# Altium schematic sheet RoBeast_Positional_Feedback.SchDoc: Positional Feedback
size A4; ApprovedBy: CR; DrawnBy: VM & IG; Revision: V1; SheetNumber: 5; SheetTotal: 9
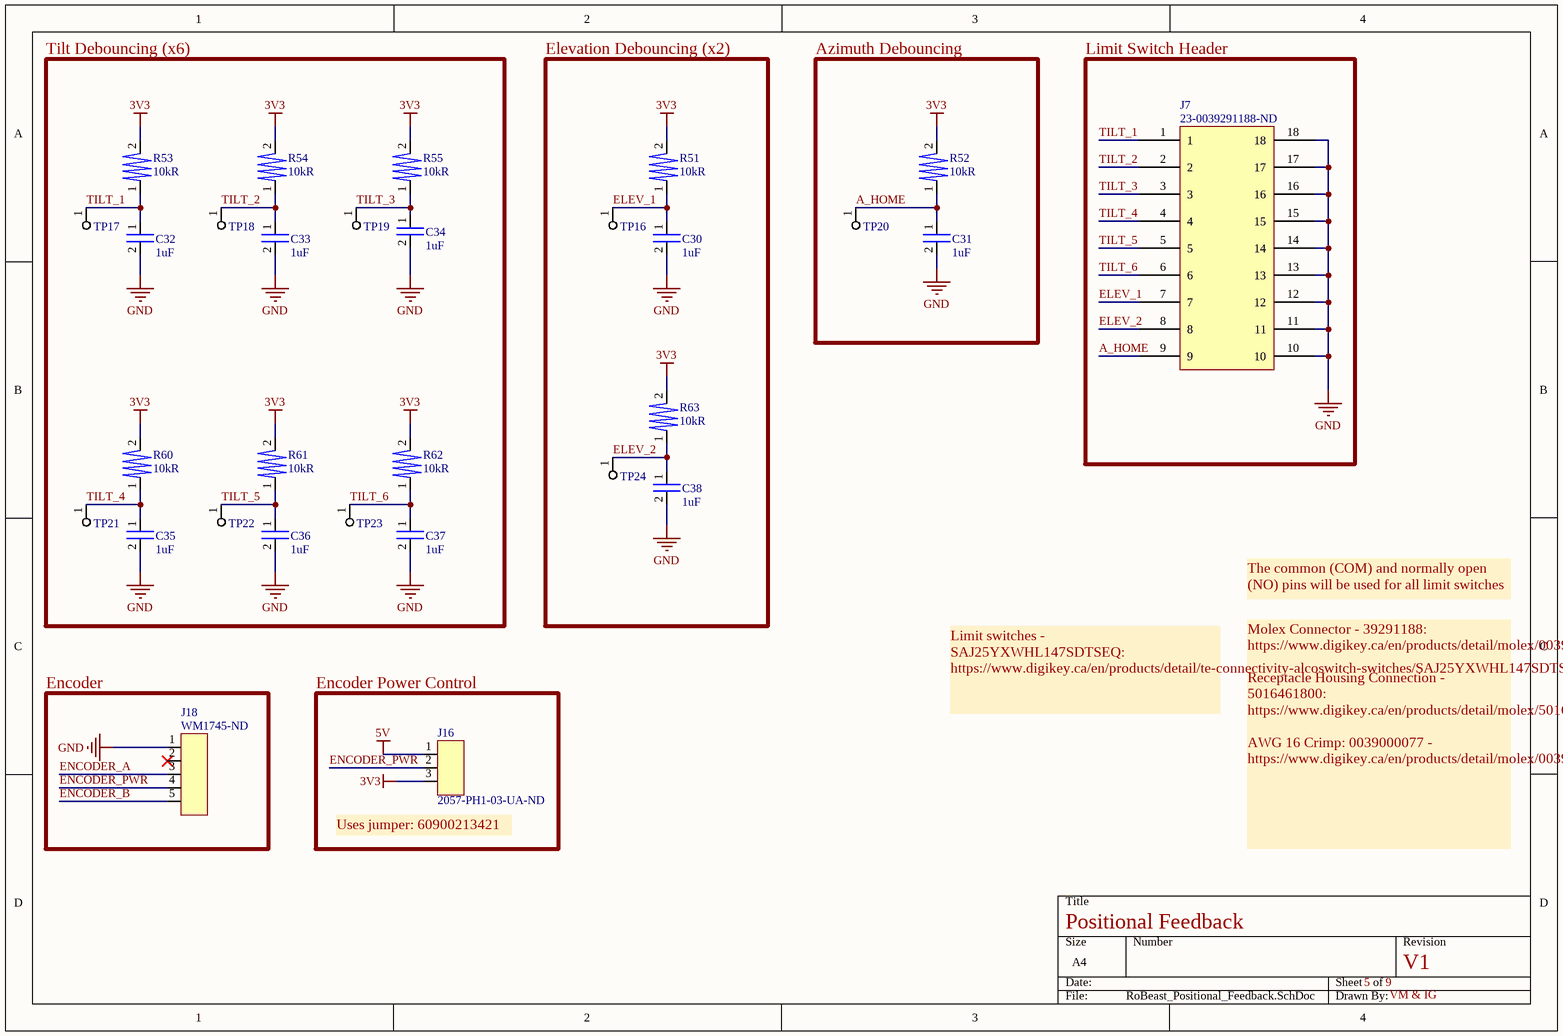
[diagram p0: RoBeast_Positional_Feedback.SchDoc]

## Parts
C30  1uF  [0805]
C31  1uF  [0805]
C32  1uF  [0805]
C33  1uF  [0805]
C34  1uF  [0805]
C35  1uF  [0805]
C36  1uF  [0805]
C37  1uF  [0805]
C38  1uF  [0805]
J7  Supplier Part Number 1: 23-0039291188-ND  [0039291188]  (hidden comment: 18 Pin Connector)
J16  Supplier Part Number 1: 2057-PH1-03-UA-ND  [PH1-03-UA]  (hidden comment: 3 Pin Connector)
J18  Supplier Part Number: WM1745-ND  [0530480510]  (hidden comment: 5 Pin Male Connector)
R51  10kR  [0805]
R52  10kR  [0805]
R53  10kR  [0805]
R54  10kR  [0805]
R55  10kR  [0805]
R60  10kR  [0805]
R61  10kR  [0805]
R62  10kR  [0805]
R63  10kR  [0805]
TP16  Test Point  [RCWCTE]  (value not drawn)
TP17  Test Point  [RCWCTE]  (value not drawn)
TP18  Test Point  [RCWCTE]  (value not drawn)
TP19  Test Point  [RCWCTE]  (value not drawn)
TP20  Test Point  [RCWCTE]  (value not drawn)
TP21  Test Point  [RCWCTE]  (value not drawn)
TP22  Test Point  [RCWCTE]  (value not drawn)
TP23  Test Point  [RCWCTE]  (value not drawn)
TP24  Test Point  [RCWCTE]  (value not drawn)

## Blocks framed on the sheet
Tilt Debouncing (x6): C32-C37 R53-R55 R60-R62 TP17-TP19 TP21-TP23
Elevation Debouncing (x2): C30 C38 R51 R63 TP16 TP24
Azimuth Debouncing: C31 R52 TP20
Limit Switch Header: J7
Encoder: J18
Encoder Power Control: J16

## Nets
3V3: J16.3 R51.2 R52.2 R53.2 R54.2 R55.2 R60.2 R61.2 R62.2 R63.2
5V: J16.1
GND: C30.2 C31.2 C32.2 C33.2 C34.2 C35.2 C36.2 C37.2 C38.2 J7.10 J7.11 J7.12 J7.13 J7.14 J7.15 J7.16 J7.17 J7.18 J18.1
A_HOME: C31.1 J7.9 R52.1 TP20.1
ELEV_1: C30.1 J7.7 R51.1 TP16.1
ELEV_2: C38.1 J7.8 R63.1 TP24.1
ENCODER_A: J18.3
ENCODER_B: J18.5
ENCODER_PWR: J16.2 J18.4
TILT_1: C32.1 J7.1 R53.1 TP17.1
TILT_2: C33.1 J7.2 R54.1 TP18.1
TILT_3: C34.1 J7.3 R55.1 TP19.1
TILT_4: C35.1 J7.4 R60.1 TP21.1
TILT_5: C36.1 J7.5 R61.1 TP22.1
TILT_6: C37.1 J7.6 R62.1 TP23.1

Not connected (* = marked no-connect by the designer): J18 2*

## Notes on the sheet
- The common (COM) and normally open (NO) pins will be used for all limit switches
- Limit switches - SAJ25YXWHL147SDTSEQ:
  https://www.digikey.ca/en/products/detail/te-connectivity-alcoswitch-switches/SAJ25YXWHL147SDTSEQ/11312233
- (near J16) Uses jumper: 60900213421
- Molex Connector - 39291188: https://www.digikey.ca/en/products/detail/molex/0039291188/356046
  Receptacle Housing Connection -  5016461800: https://www.digikey.ca/en/products/detail/molex/5016461800/1787763
  AWG 16 Crimp: 0039000077 - https://www.digikey.ca/en/products/detail/molex/0039000077/1643440

## Library data of the parts
C30-C38 = CC0805JKX7R9BB105: Ceramic Capacitor, Multilayer, Ceramic, 50V, 5% +Tol, 5% -Tol, X7R, 15% TC, 1uF, Surface Mount, 0805; Manufacturer: Yageo; Supplier 1: Digikey; Manufacturer Part Number: CC0805JKX7R9BB105; RoHS: Yes; Category: Ceramic Capacitors; Stock 1: 50247; Pricing 1: 1=0.32, 10=0.207, 50=0.1454, 100=0.1174, 500=0.08724, 1000=0.07633 (USD); ComponentLink1URL: https://datasheet.ciiva.com:443/pdfs/VipMasterIC/IC/YAGO/YAGO-S-A0003557223/YAGO-S-A0003557223-1.pdf?src-supplier=IHS+Markit; ComponentLink1Description: https://datasheet.ciiva.com:443/pdfs/VipMasterIC/IC/YAGO/YAGO-S-A0003557223/YAGO-S-A0003557223-1.pdf?src-supplier=IHS+Markit; ComponentLink2URL: http://www.yageo.com/documents/recent/UPY-GPHC_X7R_6.3V-to-50V_18.pdf?src-supplier=Digikey; ComponentLink2Description: http://www.yageo.com/documents/recent/UPY-GPHC_X7R_6.3V-to-50V_18.pdf?src-supplier=Digikey; Supplier Part Number 1: 311-3498-1-ND
J7 = 0039291188: Rectangular Power Connector, 18 Contact(s), Male, Solder Terminal, Receptacle; Manufacturer: Molex; Connector Type: Power,Rectangular; Option: General Purpose; Board Mounting Option: MOUNTING FLANGE; Contact Resistance: 10mR; Contact Style: SQ PIN-SKT; Dielectric Withstanding Voltage (AC): 1.5kV; Durability: 30Cycles; Empty Shell: No; Insertion Force-Max: 6.672N; Insulation Resistance: 1GR; Mating Information: MULTIPLE MATING PARTS AVAILABLE; Number Of Connectors: 1; Number Of PCB Rows: 2; Polarization Key: POLARIZED HOUSING; Rated Current (Signal): 6A; Number of Contacts: 18; Withdrawl Force-Min: 3.1136N; Body Breadth: 0.394inch; Body Depth: 0.72inch; Body Length: 1.929inch; Mating Contact Pitch: 0.165inch; Mounting Option 1: POLARIZED LCK; Mounting Option 2: LOCKING; PCB Contact Row Spacing: 5.5118mm; Plating Thickness: 200uin; Reference Standard: UL; Reliability: COMMERCIAL; Supplier 1: Digikey; Manufacturer Part Number: 39-29-1188; RoHS: Yes; Category: Headers and Wire Housings; Stock 1: 8423; Pricing 1: 1=4.09, 10=3.6, 100=2.8634, 1000=2.37249 (USD); Mount: Board; Contact Finish - Mating: NOT SPECIFIED; Contact Finish - Termination: Tin (Sn) - with Nickel (Ni) barrier; Insulation Material: Nylon; Shell Material: Nylon; Min Operating Temperature: -40°C; Max Operating Temperature: 105°C; JESD-609 Code: e3; Body/Shell Style: RECEPTACLE; Contact Gender: Male; Contact Pattern: RECTANGULAR; Filter Feature: No; Mixed Contacts: No; Mounting Style: RIGHT ANGLE; Number of Rows Loaded: 2; PCB Contact Pattern: RECTANGULAR; Termination: Solder; Mating Contact Row Spacing: 0.165inch; Terminal Length: 0.138inch; Terminal Pitch: 4.191mm; Flammability Rating: UL94 V-2; DIN Conformance: No; IEC Conformance: No; MIL Conformance: No; Reach SVHC Compliant: Yes; RoHS Compliant: Yes; ComponentLink1URL: https://datasheet.ciiva.com:443/pdfs/VipMasterIC/IC/MOLE/MOLE-S-A0004635529/MOLE-S-A0004635529-1.pdf?src-supplier=IHS+Markit; ComponentLink1Description: https://datasheet.ciiva.com:443/pdfs/VipMasterIC/IC/MOLE/MOLE-S-A0004635529/MOLE-S-A0004635529-1.pdf?src-supplier=IHS+Markit; ComponentLink2URL: https://datasheet.ciiva.com/711/039291028-sd-711978.pdf?src-supplier=Digikey; ComponentLink2Description: https://datasheet.ciiva.com/711/039291028-sd-711978.pdf?src-supplier=Digikey; ComponentLink3URL: https://datasheet.ciiva.com/30097/128000039291188-pcb-headers-30097010.pdf?src-supplier=Onlinecomponents.com; ComponentLink3Description: https://datasheet.ciiva.com/30097/128000039291188-pcb-headers-30097010.pdf?src-supplier=Onlinecomponents.com; ComponentLink4URL: https://datasheet.ciiva.com/26916/getdatasheetpartid-310375-26916660.pdf?src-supplier=Verical; ComponentLink4Description: https://datasheet.ciiva.com/26916/getdatasheetpartid-310375-26916660.pdf?src-supplier=Verical; ComponentLink5URL: https://datasheet.ciiva.com/11748/0900766b8059542f-11748868.pdf?src-supplier=Rs; ComponentLink5Description: https://datasheet.ciiva.com/11748/0900766b8059542f-11748868.pdf?src-supplier=Rs; ComponentLink6URL: https://datasheet.ciiva.com/5158/0039291188-pcb-headers-228408-5158739.pdf?src-supplier=Mouser; ComponentLink6Description: https://datasheet.ciiva.com/5158/0039291188-pcb-headers-228408-5158739.pdf?src-supplier=Mouser; ComponentLink7URL: https://datasheet.ciiva.com/1442/1865038-1442913.pdf?src-supplier=Element14; ComponentLink7Description: https://datasheet.ciiva.com/1442/1865038-1442913.pdf?src-supplier=Element14
J16 = PH1-03-UA: Conn Unshrouded Header HDR 3 POS 2.54mm Solder ST Thru-Hole Bag; Manufacturer: Adam Equipment; Supplier 1: Digikey; Manufacturer Part Number: PH1-03-UA; RoHS: Yes; Category: Connectors; Stock 1: 50788; Pricing 1: 1=0.1, 10=0.045, 100=0.0285, 500=0.02374, 1000=0.02136, 5000=0.01804, 10000=0.01709 (USD); ComponentLink1URL: https://datasheet.ciiva.com/16396/catpg240-254-16396026.pdf?src-supplier=Future+Electronics; ComponentLink1Description: https://datasheet.ciiva.com/16396/catpg240-254-16396026.pdf?src-supplier=Future+Electronics
J18 = 0530480510: Board Connector, 5 Contact(s), 1 Row(s), Male, Right Angle, 0.049 inch Pitch, Solder Terminal, Locking, Natural Insulator, Receptacle; Manufacturer: Molex; Manufacturer Part Number: 53048-0510; Manufacturer Series: 53048; Option: General Purpose; Contact Pattern: RECTANGULAR; Contact Resistance: 20mR; Contact Style: SQ PIN-SKT; Filter Feature: No; Insulation Resistance: 100MR; Mating Information: MULTIPLE MATING PARTS AVAILABLE; Number Of Connectors: 1; Number of Contacts: 5; Body Breadth: 0.138inch; Body Depth: 0.217inch; Body Length: 0.315inch; Reliability: COMMERCIAL; Supplier: Digikey; RoHS: Yes; Category: Headers and Wire Housings; Stock: 61267; Pricing: 1=0.49, 10=0.414, 80=0.32175, 4000=0.22983, 8000=0.20684, 12000=0.20378 (USD); Mounting Technology: Board; Contact Finish - Mating: TIN; Contact Material: Bronze; Contact Finish - Termination: Tin (Sn); Insulation Color: Natural; Insulation Material: Nylon; Min Operating Temperature: -40°C; Max Operating Temperature: 85°C; Connector Type: BOARD CONNECTOR; JESD-609 Code: e3; Body/Shell Style: RECEPTACLE; Contact Gender: Male; Mixed Contacts: No; Mounting Style: RIGHT ANGLE; Number Of PCB Rows: 1; Number of Rows Loaded: 1; PCB Contact Pattern: RECTANGULAR; Termination: Solder; Mating Contact Pitch: 0.049inch; Mounting Option 1: LOCKING; Terminal Length: 0.091inch; Terminal Pitch: 1.25mm; Flammability Rating: UL94 V-0; Reach SVHC Compliant: Yes; RoHS Compliant: Yes; DIN Conformance: No; IEC Conformance: No; MIL Conformance: No; ComponentLink1URL: https://datasheet.ciiva.com:443/pdfs/VipMasterIC/IC/MOLE/MOLE-S-A0001318164/MOLE-S-A0001396416-1.pdf?src-supplier=IHS+Markit; ComponentLink1Description: https://datasheet.ciiva.com:443/pdfs/VipMasterIC/IC/MOLE/MOLE-S-A0001318164/MOLE-S-A0001396416-1.pdf?src-supplier=IHS+Markit
R51-R55 R60-R63 = RMCF0805FT10K0: Fixed Resistor, Metal Glaze/thick Film, 0.125W, 10000ohm, 150V, 1% +/-Tol, 100ppm/Cel, Surface Mount, 0805; Manufacturer: Stackpole Electronics; Rated Power Dissipation (P): 125mW; Rated Temperature: 70°C; Temperature Coefficient: 100ppm/°C; Package Height: 0.5mm; Package Length: 2mm; Package Width: 1.25mm; Reference Standard: AEC-Q200; Supplier 1: Digikey; Manufacturer Part Number: RMCF0805FT10K0; RoHS: Yes; Category: Chip SMD Resistors; Stock 1: 3602197; Pricing 1: 1=0.1, 10=0.02, 50=0.0124, 100=0.0103, 500=0.007, 1000=0.00601 (USD); Mount: Surface Mount; Number of Pins: 2; Package Shape: Rectangular; Size Code: 0805; Terminal Finish: Nickel; Min Operating Temperature: -55°C; Max Operating Temperature: 155°C; Tolerance: 1%; JESD-609 Code: e3; Resistor Type: FIXED RESISTOR; Construction: Rectangular; Package Style: SMTMeter; Packaging: Tape and Reel; Resistance: 10kR; Technology: METAL GLAZE/THICK FILM; Termination: Wraparound; Working Voltage: 150V; Reach SVHC Compliant: Yes; RoHS Compliant: Yes; ComponentLink1URL: https://datasheet.ciiva.com:443/pdfs/VipMasterIC/IC/SEIE/SEIE-S-A0009541969/SEIE-S-A0009541969-1.pdf?src-supplier=IHS+Markit; ComponentLink1Description: https://datasheet.ciiva.com:443/pdfs/VipMasterIC/IC/SEIE/SEIE-S-A0009541969/SEIE-S-A0009541969-1.pdf?src-supplier=IHS+Markit; ComponentLink2URL: https://datasheet.ciiva.com/15193/getdatasheetpartid-362046-15193525.pdf?src-supplier=Verical; ComponentLink2Description: https://datasheet.ciiva.com/15193/getdatasheetpartid-362046-15193525.pdf?src-supplier=Verical; Supplier Part Number 1: RMCF0805FT10K0CT-ND
TP16-TP24 = RCWCTE: Testing/Accessories; Manufacturer: KOA Speer; Rated Temperature: 70°C; Resistance: 0R; Package Height: 2mm; Package Length: 3.2mm; Package Width: 1.6mm; Reference Standard: AEC-Q200; Supplier 1: Digikey; Manufacturer Part Number: RCWCTE; RoHS: Yes; Category: Chip SMD Resistors; Stock 1: 132357; Pricing 1: 1=0.16, 10=0.137, 25=0.1212, 50=0.1132, 100=0.105, 250=0.09292, 500=0.08888, 1000=0.07272 (USD); Mount: Surface Mount; Number of Pins: 2; Package Shape: Rectangular; Size Code: 1206; Terminal Finish: Copper; Min Operating Temperature: -55°C; Max Operating Temperature: 125°C; JESD-609 Code: e2; Resistor Type: FIXED RESISTOR; Construction: Chip; Package Style: SMTMeter; Packaging: Tape and Reel; Termination: Wraparound; Reach SVHC Compliant: Yes; RoHS Compliant: Yes; ComponentLink1URL: https://datasheet.ciiva.com:443/pdfs/VipMasterIC/IC/KOAS/KOASS03065/KOASS03065-1.pdf?src-supplier=IHS+Markit; ComponentLink1Description: https://datasheet.ciiva.com:443/pdfs/VipMasterIC/IC/KOAS/KOASS03065/KOASS03065-1.pdf?src-supplier=IHS+Markit; ComponentLink2URL: https://datasheet.ciiva.com/34302/1876186-34302940.pdf?src-supplier=Jameco; ComponentLink2Description: https://datasheet.ciiva.com/34302/1876186-34302940.pdf?src-supplier=Jameco; ComponentLink3URL: https://datasheet.ciiva.com/5556/rc-5556236.pdf?src-supplier=Mouser; ComponentLink3Description: https://datasheet.ciiva.com/5556/rc-5556236.pdf?src-supplier=Mouser; ComponentLink4URL: https://datasheet.ciiva.com/26821/getdatasheetpartid-110197-26821157.pdf?src-supplier=Verical; ComponentLink4Description: https://datasheet.ciiva.com/26821/getdatasheetpartid-110197-26821157.pdf?src-supplier=Verical; Supplier Part Number 1: 2019-RCWCTECT-ND